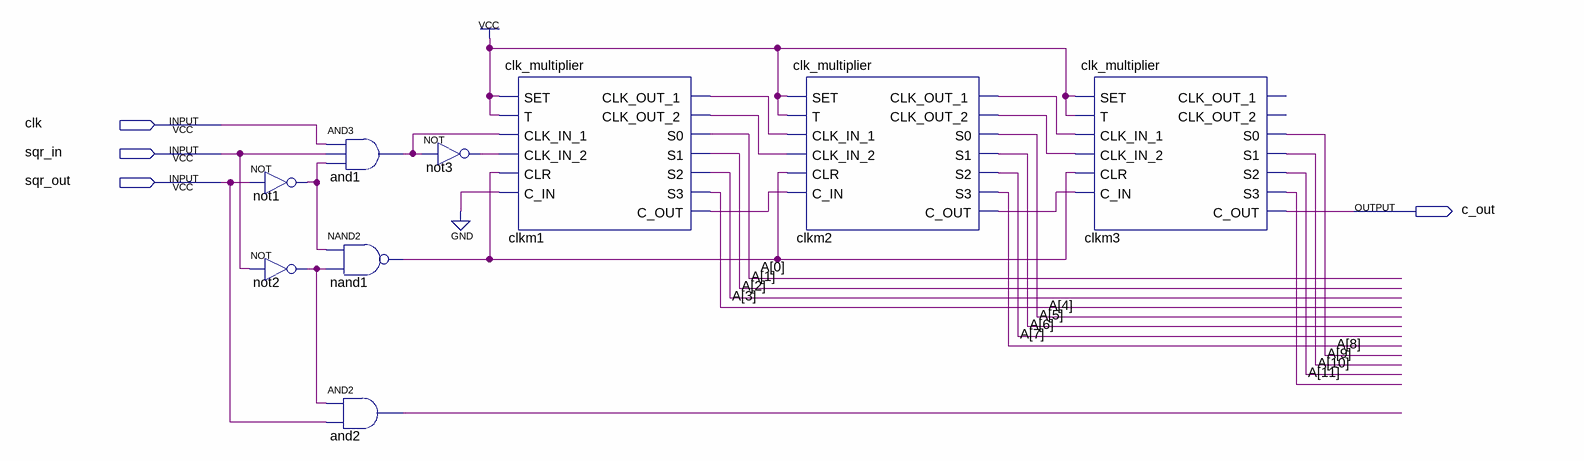
[diagram p0: schematic sheet]
// Quartus schematic nmm.bdf as structural Verilog: 9 symbols, 4 pins
module nmm (
  input  clk,
  input  sqr_in,
  input  sqr_out,
  output c_out
);

  wire and1_out, and2_out, clkm1_c_out, clkm1_clk_out_1, clkm1_clk_out_2, clkm2_c_out, clkm2_clk_out_1,
       clkm2_clk_out_2, nand1_out, not1_out, not2_out, not3_out;
  wire [11:0] A;

  not not1 (not1_out, sqr_out);
  not not2 (not2_out, sqr_in);
  and and1 (and1_out, clk, sqr_in, not1_out);
  nand nand1 (nand1_out, not1_out, not2_out);
  and and2 (and2_out, not2_out, sqr_out);
  not not3 (not3_out, and1_out);
  clk_multiplier clkm1 (
    .SET(1'b1), .T(1'b1), .CLK_IN_1(and1_out), .CLK_IN_2(not3_out), .CLR(nand1_out), .C_IN(1'b0),
    .CLK_OUT_1(clkm1_clk_out_1), .CLK_OUT_2(clkm1_clk_out_2), .S3(A[3]), .C_OUT(clkm1_c_out), .S0(A[0]),
    .S1(A[1]), .S2(A[2]));
  clk_multiplier clkm2 (
    .SET(1'b1), .T(1'b1), .CLK_IN_1(clkm1_clk_out_1), .CLK_IN_2(clkm1_clk_out_2), .CLR(nand1_out),
    .C_IN(clkm1_c_out), .CLK_OUT_1(clkm2_clk_out_1), .CLK_OUT_2(clkm2_clk_out_2), .S3(A[7]),
    .C_OUT(clkm2_c_out), .S0(A[4]), .S1(A[5]), .S2(A[6]));
  clk_multiplier clkm3 (
    .SET(1'b1), .T(1'b1), .CLK_IN_1(clkm2_clk_out_1), .CLK_IN_2(clkm2_clk_out_2), .CLR(nand1_out),
    .C_IN(clkm2_c_out), .S3(A[11]), .C_OUT(c_out), .S0(A[8]), .S1(A[9]), .S2(A[10]));  // open: CLK_OUT_1, CLK_OUT_2
endmodule
